# EAGLE design Visulizer (EAGLE 5.11)
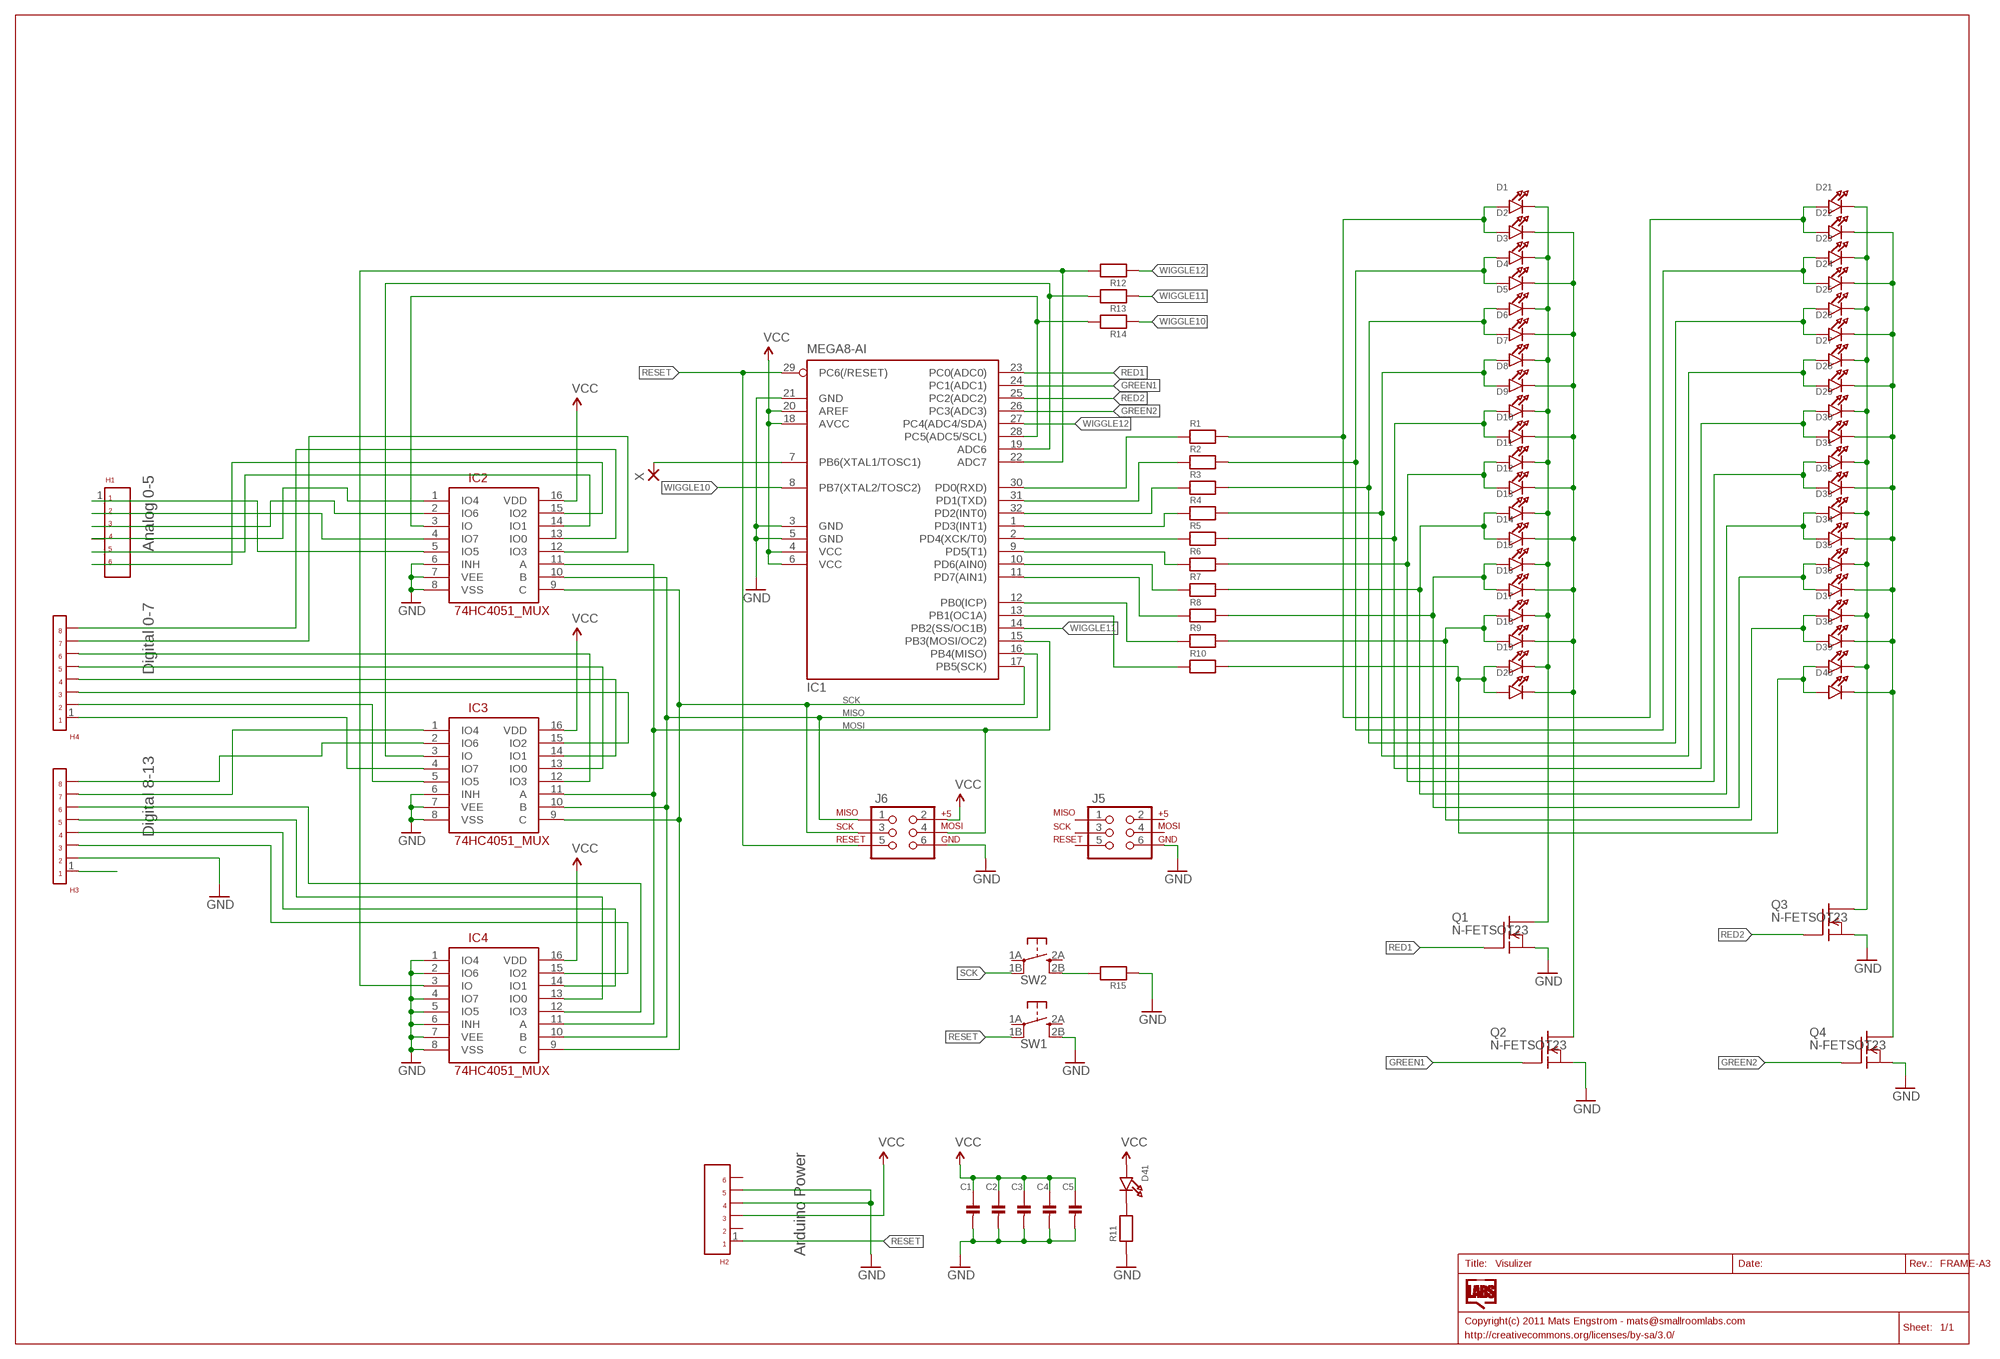
[diagram p0: schematic, sheet 1]

## Parts
C1  CAP_CERAMIC0805  [0805]
C2  CAP_CERAMIC0805  [0805]
C3  CAP_CERAMIC0805  [0805]
C4  CAP_CERAMIC0805  [0805]
C5  CAP_CERAMIC0805  [0805]
D1  LEDSMD0805  [CHIPLED_0805]
D2  LEDSMD0805  [CHIPLED_0805]
D3  LEDSMD0805  [CHIPLED_0805]
D4  LEDSMD0805  [CHIPLED_0805]
D5  LEDSMD0805  [CHIPLED_0805]
D6  LEDSMD0805  [CHIPLED_0805]
D7  LEDSMD0805  [CHIPLED_0805]
D8  LEDSMD0805  [CHIPLED_0805]
D9  LEDSMD0805  [CHIPLED_0805]
D10  LEDSMD0805  [CHIPLED_0805]
D11  LEDSMD0805  [CHIPLED_0805]
D12  LEDSMD0805  [CHIPLED_0805]
D13  LEDSMD0805  [CHIPLED_0805]
D14  LEDSMD0805  [CHIPLED_0805]
D15  LEDSMD0805  [CHIPLED_0805]
D16  LEDSMD0805  [CHIPLED_0805]
D17  LEDSMD0805  [CHIPLED_0805]
D18  LEDSMD0805  [CHIPLED_0805]
D19  LEDSMD0805  [CHIPLED_0805]
D20  LEDSMD0805  [CHIPLED_0805]
D21  LEDSMD0805  [CHIPLED_0805]
D22  LEDSMD0805  [CHIPLED_0805]
D23  LEDSMD0805  [CHIPLED_0805]
D24  LEDSMD0805  [CHIPLED_0805]
D25  LEDSMD0805  [CHIPLED_0805]
D26  LEDSMD0805  [CHIPLED_0805]
D27  LEDSMD0805  [CHIPLED_0805]
D28  LEDSMD0805  [CHIPLED_0805]
D29  LEDSMD0805  [CHIPLED_0805]
D30  LEDSMD0805  [CHIPLED_0805]
D31  LEDSMD0805  [CHIPLED_0805]
D32  LEDSMD0805  [CHIPLED_0805]
D33  LEDSMD0805  [CHIPLED_0805]
D34  LEDSMD0805  [CHIPLED_0805]
D35  LEDSMD0805  [CHIPLED_0805]
D36  LEDSMD0805  [CHIPLED_0805]
D37  LEDSMD0805  [CHIPLED_0805]
D38  LEDSMD0805  [CHIPLED_0805]
D39  LEDSMD0805  [CHIPLED_0805]
D40  LEDSMD0805  [CHIPLED_0805]
D41  LED0805  [CHIPLED_0805]
H1  HEADER1X06-F  [1X06_OVAL]
H2  HEADER1X06-F  [1X06_OVAL]
H3  HEADER1X08-F  [1X08_OVAL]
H4  HEADER1X08-F  [1X08_OVAL]
IC1  MEGA8-AI  [TQFP32-08]
IC2  74HC4051_MUX  [SO16]
IC3  74HC4051_MUX  [SO16]
IC4  74HC4051_MUX  [SO16]
J5  AVR_SPI_PRG_6NS  [2X3-NS]
J6  AVR_SPI_PRG_6NS  [2X3-NS]
Q1  N-FETSOT23  [SOT23]
Q2  N-FETSOT23  [SOT23]
Q3  N-FETSOT23  [SOT23]
Q4  N-FETSOT23  [SOT23]
R1  RESISTOR0805  [0805]
R2  RESISTOR0805  [0805]
R3  RESISTOR0805  [0805]
R4  RESISTOR0805  [0805]
R5  RESISTOR0805  [0805]
R6  RESISTOR0805  [0805]
R7  RESISTOR0805  [0805]
R8  RESISTOR0805  [0805]
R9  RESISTOR0805  [0805]
R10  RESISTOR0805  [0805]
R11  RESISTOR0805  [0805]
R12  RESISTOR0805  [0805]
R13  RESISTOR0805  [0805]
R14  RESISTOR0805  [0805]
R15  RESISTOR0805  [0805]
SW1  TACTILE  [EVQ-Q2]
SW2  TACTILE  [EVQ-Q2]
X  WIREPAD1,6/0,8  [1,6/0,8]

## Nets
GND [power]: C1.2 C2.2 C3.2 C4.2 C5.2 H2.4 H2.5 H3.2 IC1.3(GND) IC1.5(GND) IC1.21(GND) IC2.6(INH) IC2.7(VEE) IC2.8(VSS) IC3.6(INH) IC3.7(VEE) IC3.8(VSS) IC4.1(IO4) IC4.2(IO6) IC4.4(IO7) IC4.5(IO5) IC4.6(INH) IC4.7(VEE) IC4.8(VSS) J5.6 J6.6 Q1.2(S) Q2.2(S) Q3.2(S) Q4.2(S) R11.1 R15.1 SW1.2B
GREEN1: IC1.24(PC1(ADC1)) Q2.1(G)
GREEN1BUS: D2.C D4.C D6.C D8.C D10.C D12.C D14.C D16.C D18.C D20.C Q2.3(D)
GREEN2: IC1.26(PC3(ADC3)) Q4.1(G)
GREEN2BUS: D22.C D24.C D26.C D28.C D30.C D32.C D34.C D36.C D38.C D40.C Q4.3(D)
MISO: IC1.16(PB4(MISO)) IC2.10(B) IC3.10(B) IC4.10(B) J6.1
MOSI: IC1.15(PB3(MOSI/OC2)) IC2.11(A) IC3.11(A) IC4.11(A) J6.4
MUX1: IC1.28(PC5(ADC5/SCL)) IC2.3(IO) R14.2
MUX2: IC1.19(ADC6) IC3.3(IO) R13.2
MUX3: IC1.22(ADC7) IC4.3(IO) R12.2
N$1: H1.1 IC2.5(IO5)
N$2: H1.2 IC2.4(IO7)
N$3: H1.3 IC2.2(IO6)
N$4: H1.4 IC2.1(IO4)
N$5: H1.5 IC2.14(IO1)
N$6: H1.6 IC2.15(IO2)
N$7: H4.8 IC2.13(IO0)
N$8: H4.7 IC2.12(IO3)
N$9: H4.6 IC3.12(IO3)
N$10: H4.5 IC3.13(IO0)
N$11: H4.4 IC3.14(IO1)
N$12: H4.3 IC3.15(IO2)
N$13: H4.2 IC3.5(IO5)
N$14: H4.1 IC3.4(IO7)
N$15: H3.8 IC3.2(IO6)
N$16: H3.7 IC3.1(IO4)
N$17: R15.2 SW2.2B
N$18: H3.1
N$19: H3.3 IC4.15(IO2)
N$20: H3.6 IC4.12(IO3)
N$21: IC1.30(PD0(RXD)) R1.1
N$25: IC1.31(PD1(TXD)) R2.1
N$27: IC1.32(PD2(INT0)) R3.1
N$28: IC1.1(PD3(INT1)) R4.1
N$29: IC1.2(PD4(XCK/T0)) R5.1
N$30: IC1.9(PD5(T1)) R6.1
N$31: IC1.10(PD6(AIN0)) R7.1
N$32: IC1.11(PD7(AIN1)) R8.1
N$33: IC1.12(PB0(ICP)) R9.1
N$34: IC1.13(PB1(OC1A)) R10.1
N$37: IC1.7(PB6(XTAL1/TOSC1)) X.1(P)
N$38: D41.C R11.2
N$40: H3.5 IC4.13(IO0)
N$41: H3.4 IC4.14(IO1)
N$46: D15.A D16.A D35.A D36.A R8.2
N$47: D17.A D18.A D37.A D38.A R9.2
N$48: D19.A D20.A D39.A D40.A R10.2
N$52: D1.A D2.A D21.A D22.A R1.2
N$53: D3.A D4.A D23.A D24.A R2.2
N$54: D5.A D6.A D25.A D26.A R3.2
N$55: D7.A D8.A D27.A D28.A R4.2
N$56: D9.A D10.A D29.A D30.A R5.2
N$57: D11.A D12.A D31.A D32.A R6.2
N$58: D13.A D14.A D33.A D34.A R7.2
RED1: IC1.23(PC0(ADC0)) Q1.1(G)
RED1BUS: D1.C D3.C D5.C D7.C D9.C D11.C D13.C D15.C D17.C D19.C Q1.3(D)
RED2: IC1.25(PC2(ADC2)) Q3.1(G)
RED2BUS: D21.C D23.C D25.C D27.C D29.C D31.C D33.C D35.C D37.C D39.C Q3.3(D)
RESET: H2.1 IC1.29(PC6(/RESET)) J6.5 SW1.1B
SCK: IC1.17(PB5(SCK)) IC2.9(C) IC3.9(C) IC4.9(C) J6.3 SW2.1B
VCC [power]: C1.1 C2.1 C3.1 C4.1 C5.1 D41.A H2.3 IC1.4(VCC) IC1.6(VCC) IC1.18(AVCC) IC1.20(AREF) IC2.16(VDD) IC3.16(VDD) IC4.16(VDD) J6.2
WIGGLE10: IC1.8(PB7(XTAL2/TOSC2)) R14.1
WIGGLE11: IC1.14(PB2(SS/OC1B)) R13.1
WIGGLE12: IC1.27(PC4(ADC4/SDA)) R12.1
Unconnected: H2.2 H2.6 J5.1 J5.2 J5.3 J5.4 J5.5 SW1.1A SW1.2A SW2.1A SW2.2A

## Notes on the sheet
- Analog 0-5
- Digital 0-7
- Digital 8-13
- Arduino Power

## Library data of the parts
C1-C5 = microbuilder:CAP_CERAMIC: Ceramic Capacitors 0402 - 0402 Surface Mount Capacitors 0.1uF 10V 10% [Digikey: 490-1318-2-ND] 0603 - 0603 Surface Mount Capacitors 16 pF 50V 5% [Digikey: 445-5051-2-ND] 22 pF 50V [Digikey: PCC220ACVTR-ND] 33 pF 50V 5% [Digikey: 490-1415-1-ND] 56pF 50V 5% [Digikey: 490-1421-1-ND] 220pF 50V 5% [Digikey: 445-1285-1-ND] 680 pF 50V 2200 pF 50V 5% C0G [Digikey: 445-1297-1-ND] 5600 pF 100V 5% X7R [Digikey: 478-3711-1-ND] 0.1 µF 25V 10% [Digikey: PCC2277TR-ND] 0.22 µF 16V 10% X7R [Digikey: 445-1318-1-ND] 1.0 µF 25V 10% [Digikey: 445-5146-2-ND] 0603 - RF Specific 3pF 250V +/-0.1pF RF [Digikey: 712-1347-1-ND] 18 pF 250V 5% [Digikey: 478-3505-1-ND or 712-1322-1-ND] 56 pF 250V 5% C0G RF [Digikey: 490-4867-1-ND] 68 pF 250V RF [Digikey: 490-4868-1-ND] 0805 - 0805 Surface Mount Capacitors 220 pF 250V 2% RF Ceramic Capacitor [Digikey: 712-1398-1-ND] 1000 pF 50V 2% NP0 Ceramic Capacitor [Digikey: 478-3760-1-ND] 0.1 µF 25V 10% Ceramic Capacitor [Digikey: PCC1828TR-ND] 1.0 µF 16V 10% Ceramic Capacitor[Digikey: 490-1691-2-ND] 10.0 µF 10V 10% Ceramic Capacitor[Digikey: 709-1228-1-ND] 1206 - 1206 Surface Mount Capacitors
D1-D40 = SmallRoomLabs:LED
D41 = microbuilder:LED: LED 0603 - 0603 Surface Mount Package Green LED - Low Power (3.9mcd, 2ma, 1.7Vf) Orange LED - Low Power (9.8mcd, 2ma, 1.8Vf) Red LED - Low Power (5mcd, 2ma, 1.8Vf) Yellow LED - Low Power (7mcd, 2ma, 1.8Vf) 0805 - 0805 Surface Mount Package 20mA: Red LED (104mcd, 20mA, Diffused) - LS R976 [Digikey: 475-1278-6-ND] Red LED (12mcd, 20mA, 2.0Vf, Clear) - APT2012EC [Digikey: 754-1128-1-ND] Green LED (15mcd, 20mA, 2.2Vf, Clear) - APT2012GC [Digikey: 754-1131-1-ND] Orange LED (160mcd, 20mA, 2.1Vf, Clear) - APT2012SECK [Digikey: 754-1130-1-ND] 2mA: Red LED (8.8mcd, 2mA, 1.8Vf, Clear) - Low Power [Digikey: 475-2510-1-ND] Green LED (5mcd, 2mA, 1.8Vf, Clear) - Low Power [Digikey: 475-2730-1-ND] Yellow LED (11.3mcd, 2mA, 1.8Vf, Clear) - Low Power [Digikey: 475-2555-1-ND] 1206 - 1206 Surface Mount Package Green LED (26mcd, 20mA, Diffused) - LG N971 [Digikey: 475-1407-6-ND] Red LED (15mcd, 20mA, Diffused) - LH N974 [Digikey: 475-1416-6-ND]
H1 H2 = SmallRoomLabs:HEADER1X06; EAGLEUP: F1X6
H3 H4 = SmallRoomLabs:HEADER1X08; EAGLEUP: F1X8
IC1 = atmel:MEGA8: MICROCONTROLLER 8 Kbytes FLASH, 1 kbytes SRAM, 512 bytes EEPROM, USART, 6-channel 10 bit ADC, 2-channel 8 bit ADC Pin compatible with Atmega48, ATMega88, ATMega168 Source: avr.lbr; MPN: ATMEGA8-16AU; OC_FARNELL: 9171371; OC_NEWARK: 73M8863
IC2-IC4 = SparkFun:74HC4051_MUX
J5 J6 = SparkFun:AVR_SPI_PRG_6: AVR ISP 6 Pin This is the reduced ISP connector for AVR programming. Common on Arduino. This footprint will take up less PCB space and can be used with a 10-pin to 6-pin adapter such as SKU: BOB-08508
Q1-Q4 = SmallRoomLabs:N-FET
R1-R15 = microbuilder:RESISTOR: Resistors 0402 - 0402 Surface Mount Package 10.0K 1% 1/16W [Digikey: 311-10.0KLRTR-ND] 0603 - 0603 Surface Mount Package 0 Ohm 1/10 Watt 1% Resistor 15 Ohm 1/10 Watt 1% Resistor 33 Ohm 1/10 Watt 1% Resistor 49.9 Ohm 1/10 Watt 1% Resistor 100 Ohm 1/10 Watt 1% Resistor 150 Ohm 1/10 Watt 1% Resistor 240 Ohm 1/10 Watt 1% Resistor 390 Ohm 1/10 Watt 1% Resistor 560 Ohm 1/10 Watt 1% Resistor 750 Ohm 1/10 Watt 1% Resistor 1.0K Ohm 1/10 Watt 1% Resistor 1.5K Ohm 1/10 Watt 1% Resistor 2.0K Ohm 1/10 Watt 1% Resistor 4.7K Ohm 1/10 Watt 1% Resistor 10.0K Ohm 1/10 Watt 1% Resistor 20.0K Ohm 1/10 Watt 1% Resistor 33.0K Ohm 1/10 Watt 1% Resistor 100.0K Ohm 1/10 Watt 1% Resistor 0805 - 0805 Surface Mount Package 0 Ohm 1/8 Watt 1% Resistor 33 Ohm 1/8 Watt 1% Resistor 100 Ohm 1/8 Watt 1% Resistor 150 Ohm 1/8 Watt 1% Resistor 200 Ohm 1/8 Watt 1% Resistor 240 Ohm 1/8 Watt 1% Resistor 330 Ohm 1/8 Watt 1% Resistor 390 Ohm 1/8 Watt 1% Resistor 470 Ohm 1/8 Watt 1% Resistor 1.0K Ohm 1/8 Watt 1% Resistor 1.5K Ohm 1/8 Watt 1% Resistor 2.0K Ohm 1/8 Watt 1% Resistor 4.7K Ohm 1/8 Watt 1% Resistor 5.1K Ohm 1/8 Watt 1% Resistor 5.6K Ohm 1/8 Watt 1% Resistor 10.0K Ohm 1/8 Watt 1% Resistor 22.0K Ohm 1/8 Watt 1% Resistor 33.0K Ohm 1/8 Watt 1% Resistor 100K Ohm 1/8 Watt 1% Resistor 1206 - 1206 Surface Mount Package
SW1 SW2 = SmallRoomLabs:TACTILE
X = wirepad:WIREPAD: Wire PAD connect wire on PCB

## Net classes
0 default: width 0.203 mm, drill 0.305 mm, clearance 0.203 mm
1 power: width 0.203 mm, drill 0.305 mm, clearance 0.203 mm

## Board
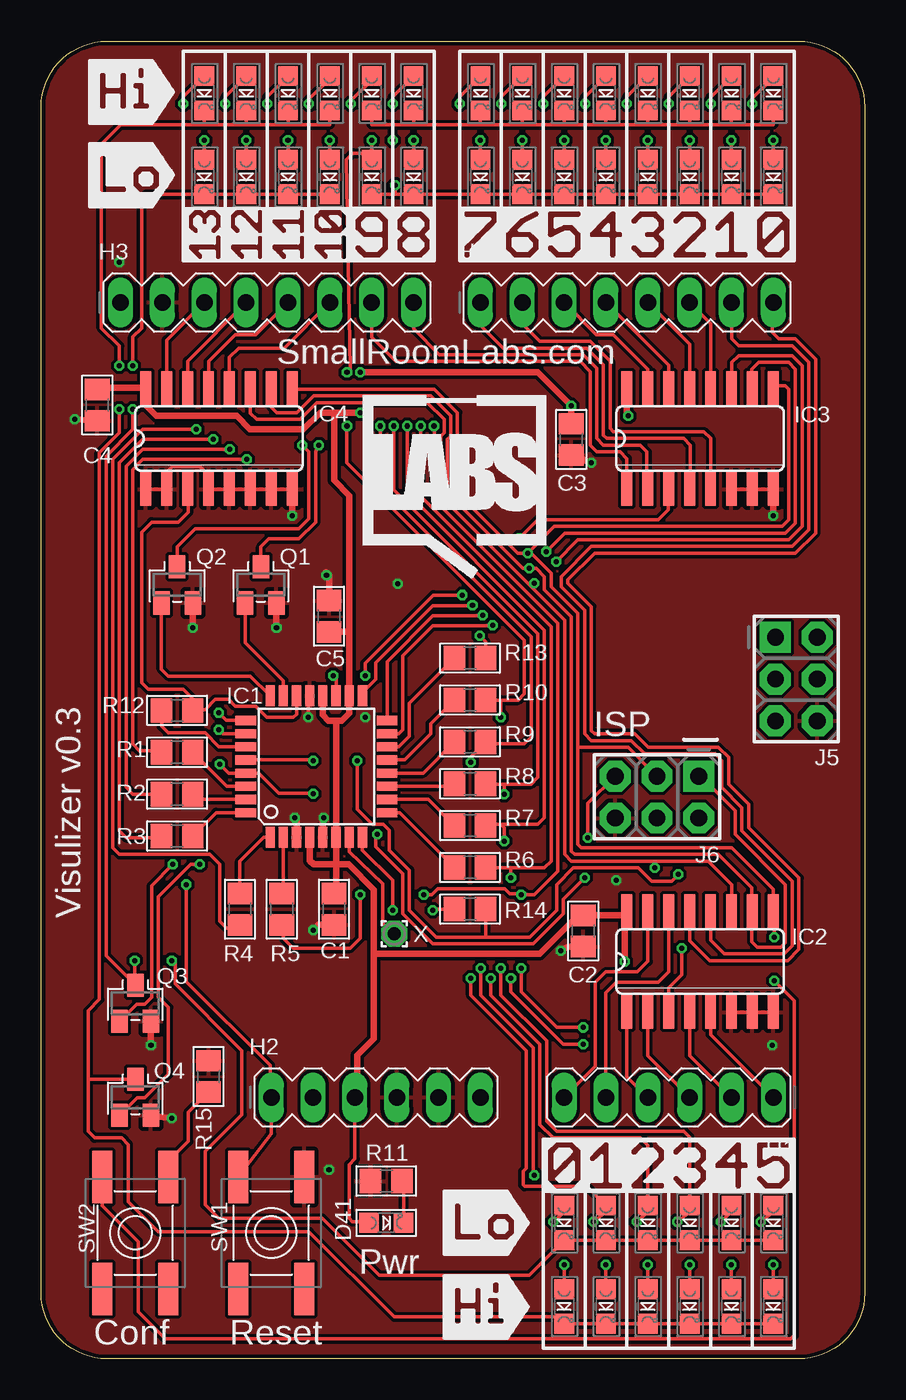
[diagram p1: board, top side]
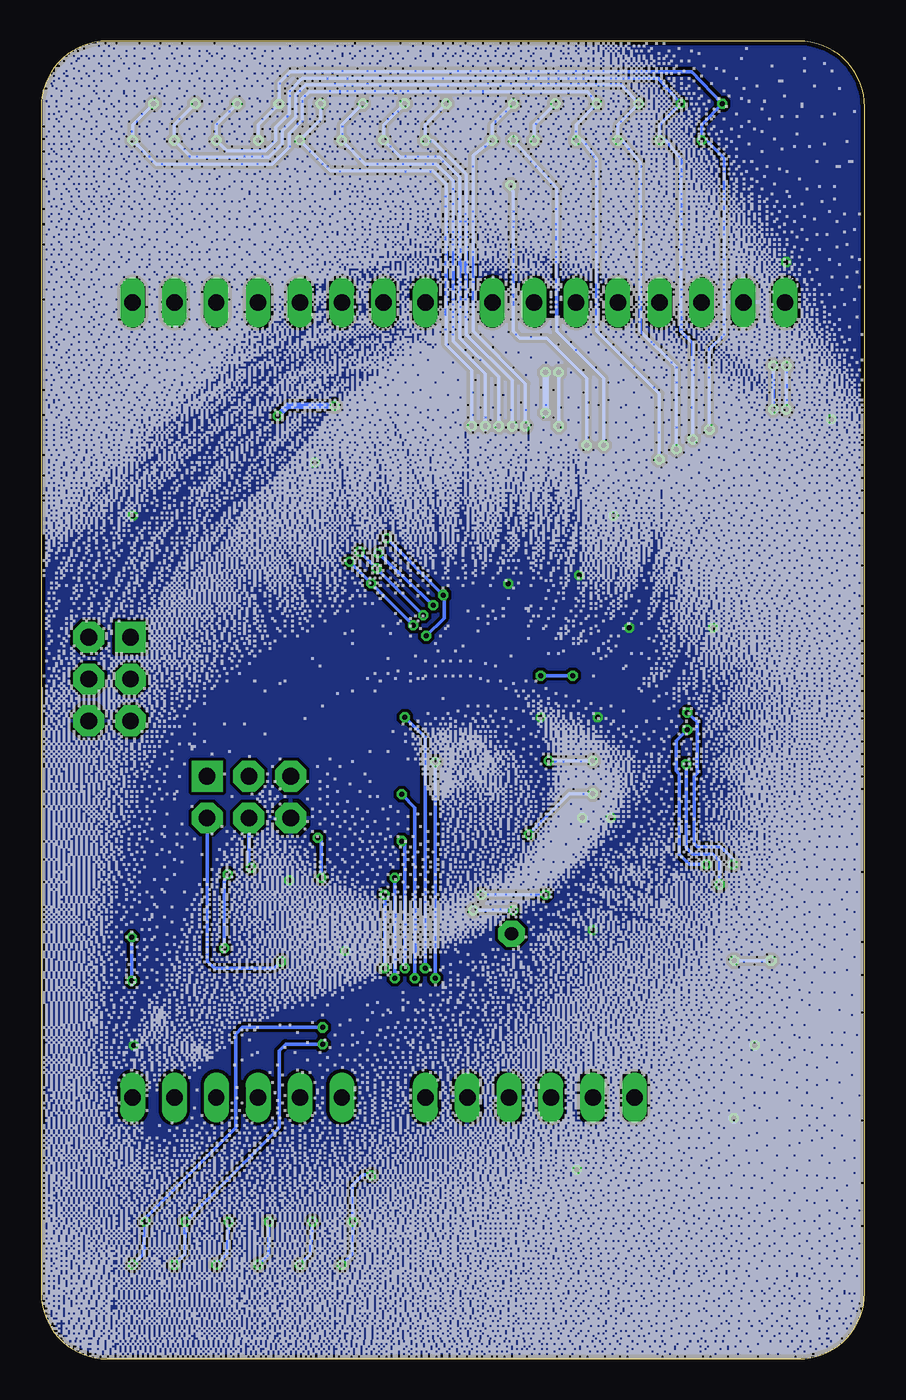
[diagram p2: board, bottom side, seen from below]

Size 50 x 80 mm. Coordinates in mm from the lower left corner, seen from the top.
Outline: 46,80 arc-90 50,76 50,4 arc-90 46,0 4,0 arc-90 0,4 0,76 arc-90 4,80 46,80
Copper layers (1*16): Top 0.035mm / dielectric 1.5mm / Bottom 0.035mm
Design rules "Fusion_eagle_rule_v1.1": minimum track width 6mil, minimum drill 12mil, track to track 6mil, track to pad 6mil, pad to pad 6mil, via to via 6mil, smd to smd 0mil, copper to edge 10mil, drill to drill 10mil, minimum pad ring 10mil, minimum via ring 6mil, stop-mask expansion 2mil, vias tented up to drill 100mil, thermal gap 10mil

### Footprints (pad centres in the part's own frame; a part is rotated, then mirrored left to right if it is on the bottom)
0805 = smd 1.3 x 1.5: 1 -0.95,0; 2 0.95,0
CHIPLED_0805 = smd 1.2 x 1.2: A 0,-1.05; C 0,1.05
1X06_OVAL = drill 1 long: 1 0,0; 2 2.54,0; 3 5.08,0; 4 7.62,0; 5 10.16,0; 6 12.7,0
1X08_OVAL = drill 1 long: 1 0,0; 2 2.54,0; 3 5.08,0; 4 7.62,0; 5 10.16,0; 6 12.7,0; 7 15.24,0; 8 17.78,0
TQFP32-08 = smd 1.27 x 0.559: 1 -4.293,2.8; 2 -4.293,2; 3 -4.293,1.2; 4 -4.293,0.4; 5 -4.293,-0.4; 6 -4.293,-1.2; 7 -4.293,-2; 8 -4.293,-2.8; 17 4.293,-2.8; 18 4.293,-2; 19 4.293,-1.2; 20 4.293,-0.4; 21 4.293,0.4; 22 4.293,1.2; 23 4.293,2; 24 4.293,2.8 | smd 0.559 x 1.27: 9 -2.8,-4.293; 10 -2,-4.293; 11 -1.2,-4.293; 12 -0.4,-4.293; 13 0.4,-4.293; 14 1.2,-4.293; 15 2,-4.293; 16 2.8,-4.293; 25 2.8,4.293; 26 2,4.293; 27 1.2,4.293; 28 0.4,4.293; 29 -0.4,4.293; 30 -1.2,4.293; 31 -2,4.293; 32 -2.8,4.293
SO16 = smd 0.66 x 2.032: 1 -4.445,-3.073; 2 -3.175,-3.073; 3 -1.905,-3.073; 4 -0.635,-3.073; 5 0.635,-3.073; 6 1.905,-3.073; 7 3.175,-3.073; 8 4.445,-3.073; 9 4.445,3.073; 10 3.175,3.073; 11 1.905,3.073; 12 0.635,3.073; 13 -0.635,3.073; 14 -1.905,3.073; 15 -3.175,3.073; 16 -4.445,3.073
2X3-NS = drill 1.016 pad 1.88 square: 1 -2.54,-1.27 | drill 1.016 pad 1.88 octagon: 2 -2.54,1.27; 3 0,-1.27; 4 0,1.27; 5 2.54,-1.27; 6 2.54,1.27
SOT23 = smd 1 x 1.4: 1 -0.95,-1.1; 2 0.95,-1.1; 3 0,1.1
EVQ-Q2 = smd 3.2 x 1.2: 1A -3.4,2; 1B 3.4,2; 2A -3.4,-2; 2B 3.4,-2
1,6/0,8 = drill 0.813 pad 1.6 octagon: 1 0,0

### Placement (x,y rotation side)
C1  17.78,27.3 270 top
C2  32.91,25.98 270 top
C3  32.18,55.82 270 top
C4  3.4,57.91 270 top
C5  17.48,45.09 90 top
D1  44.45,71.75 180 top
D2  44.45,76.83 180 top
D3  41.91,71.75 180 top
D4  41.91,76.83 180 top
D5  39.37,71.75 180 top
D6  39.37,76.83 180 top
D7  36.83,71.75 180 top
D8  36.83,76.83 180 top
D9  34.29,71.75 180 top
D10  34.29,76.83 180 top
D11  31.75,71.75 180 top
D12  31.75,76.83 180 top
D13  29.21,71.75 180 top
D14  29.21,76.83 180 top
D15  26.67,71.75 180 top
D16  26.67,76.83 180 top
D17  22.61,71.75 180 top
D18  22.61,76.83 180 top
D19  20.07,71.75 180 top
D20  20.07,76.83 180 top
D21  17.53,71.75 180 top
D22  17.53,76.83 180 top
D23  14.99,71.75 180 top
D24  14.99,76.83 180 top
D25  12.45,71.75 180 top
D26  12.45,76.83 180 top
D27  9.91,71.75 180 top
D28  9.91,76.83 180 top
D29  44.45,8.26 180 top
D30  44.45,3.17 180 top
D31  41.91,8.26 180 top
D32  41.91,3.17 180 top
D33  39.37,8.26 180 top
D34  39.37,3.17 180 top
D35  36.83,8.26 180 top
D36  36.83,3.17 180 top
D37  34.29,8.26 180 top
D38  34.29,3.17 180 top
D39  31.75,8.26 180 top
D40  31.75,3.17 180 top
D41  20.95,8.26 270 top
H1  44.45,15.88 180 top
H2  13.97,15.88 0 top
H3  4.83,64.14 0 top
H4  26.67,64.14 0 top
IC1  16.7,35.96 90 top
IC2  40.01,24.12 0 top
IC3  40.01,55.87 0 top
IC4  10.79,55.87 0 top
J5  45.85,41.27 270 top
J6  37.39,34.11 180 top
Q1  13.34,46.99 0 top
Q2  8.26,46.99 0 top
Q3  5.71,21.59 0 top
Q4  5.71,15.88 0 top
R1  8.26,36.82 180 top
R2  8.26,34.28 180 top
R3  8.26,31.74 180 top
R4  12.06,27.3 270 top
R5  14.61,27.3 270 top
R6  26.04,29.84 0 top
R7  26.04,32.38 0 top
R8  26.04,34.92 0 top
R9  26.04,37.46 0 top
R10  26.04,40 0 top
R11  20.95,10.79 0 top
R12  8.26,39.37 0 top
R13  26.04,42.55 0 top
R14  26.04,27.3 0 top
R15  10.16,17.14 270 top
SW1  13.97,7.65 90 top
SW2  5.71,7.65 90 top
U$1  [SRL-LOGO-SILK-10MM]  19.53,47.37 0 top
U$3  [ARDUINO-REFONLY]  -19.05,13.34 0 top  (outside the outline)
X  21.44,25.81 0 top

### Tracks (layer width: path | path; a pad name or v marks a point on that pad's centre or on a via)
GND  (via drill 0.3)
  Top 0.203: IC2.6 IC2.7 IC2.8 44.6,21.05 | IC1.21 16.22,40.17 v16.22,38.96 | IC4.8 IC4.7 IC4.6 IC4.5 IC4.4 10.03,52.93 10.03,53.79 9.63,54.2 8,54.2 7.62,53.82 IC4.2 IC4.1 | IC3.8 IC3.7 IC3.6 | 17.1,32.79 v17.14,32.86
  Top 0.406: v15.41,32.86 15.5,32.77 IC1.3 | C3.2 v33.4,54.4 | IC4.8 v15.24,51.2 | IC3.8 v44.45,51.2 | v2.03,57.04 C4.2 | IC1.5 17.1,32.79 | Q2.2 9.21,44.45 v9.21,44.4 | Q1.2 14.29,44.45 v14.29,44.4 | v6.67,19.05 Q3.2 | v7.94,14.61 Q4.2 | v16.51,26.04 16.82,26.35 C1.2 | v31.55,24.77 32.01,25.03 C2.2 | C5.2 17.48,47.55 17.27,47.75
  other vias: 44.37,19.04 17.32,47.57 17.48,11.48 34.92,29.05 4.75,66.59 19.68,38.96 21.64,47.07
  pour Bottom: 25,80 46,80 arc-90 50,76 50,42 50,4 arc-90 46,0 24,0 4,0 arc-90 0,4 0,40 0,76 arc-90 4,80
  pour Top: 25,80 46,80 arc-90 50,76 50,35 50,4 arc-90 46,0 23,0 4,0 arc-90 0,4 0,45 0,76 arc-90 4,80
GREEN1
  Top 0.203: IC1.24 12.7,41.45 7.72,41.45 7.3,41.87 Q2.1
GREEN1BUS  (via drill 0.3)
  Top 0.203: D2.C 44.37,75.51 | D2.C 44.5,75.64 | v15.85,55.47 16.26,55.07 16.26,51 15.65,50.39 9.35,50.39 8.26,49.3 Q2.3 | D2.C 44.45,74.93 41.91,74.93 | 22.61,74.93 26.67,74.93 | 26.67,74.93 29.21,74.93 | 29.21,74.93 31.75,74.93 | 31.75,74.93 34.29,74.93 | 34.29,74.93 36.83,74.93 | 36.83,74.93 39.37,74.93 | 39.37,74.93 41.91,74.93 | D20.C 20.07,74.93 21.34,74.93 | 22.61,74.93 D18.C | 26.67,74.93 D16.C | 29.21,74.93 D14.C | 31.75,74.93 D12.C | 34.29,74.93 D10.C | 36.83,74.93 D8.C | 39.37,74.93 D6.C | 41.91,74.93 D4.C | 21.34,74.93 22.61,74.93 | v21.34,73.98 21.34,74.93
  Bottom 0.203: v15.85,55.47 15.85,59.54 18.69,62.38 18.69,71.08 v21.34,73.98
GREEN2  (via drill 0.3)
  Top 0.203: v9.63,30.02 9.09,30.02 7.11,28.04 7.11,21.95 7.72,21.34 7.72,17.27 6.3,15.85 5.84,15.85 Q4.1 | IC1.26 11.01,37.96 v10.77,38.2
  Bottom 0.203: v10.77,38.2 11.46,37.53 11.46,35.71 11.25,35.5 11.25,30.63 10.64,30.02 v9.63,30.02
GREEN2BUS  (via drill 0.3)
  Top 0.203: D30.C D32.C D34.C D36.C D38.C D40.C 31.34,2.54 21.44,2.54 16.26,7.72 7.11,7.72 5.28,9.55 5.28,13.01 4.88,13.41 3.25,13.41 2.85,13.82 2.85,17.07 | D28.C 9.75,75.44 | v4.75,57.65 4.75,56.23 3.53,55.01 3.53,21.82 2.85,21.13 2.85,17.07 | D28.C 9.44,75.51 | v4.75,60.29 4.75,61.49 3.66,62.59 3.66,73.75 4.84,74.93 9.91,74.93 | D28.C 9.81,75.51 | 5.62,17.07 Q4.3 2.94,16.98 2.85,17.07 | 9.91,74.93 D28.C | 9.91,74.93 12.45,74.93 | 12.45,74.93 14.99,74.93 | 14.99,74.93 17.53,74.93 D22.C | 14.99,74.93 D24.C | 12.45,74.93 D26.C
  Bottom 0.203: v4.75,57.65 v4.75,60.29
MISO  (via drill 0.3)
  Top 0.203: IC4.10 13.97,57.78 14.3,57.45 15.52,57.45 16.54,58.46 23.65,58.46 24.87,57.24 24.87,56.03 24.66,55.82 24.66,52.57 29.23,48 v29.64,48 30.05,48 30.56,47.49 30.56,46.68 32.18,45.05 32.18,30.83 32.38,30.63 41.12,30.63 43.16,28.59 43.16,27.22 IC2.10 43.16,27.17 43.16,25.32 43.48,24.99 44.91,24.99 45.19,25.27 45.19,28.8 42.14,31.84 42.14,33.27 40.72,34.69 40.62,34.69 J6.1 | IC3.10 43.16,58.97 43.16,60.09 43.56,60.5 45.39,60.5 45.8,60.09 45.8,50.74 45.19,50.13 31.77,50.13 v30.66,49.02 | IC1.16 21,42.33 23.77,45.11 26.75,45.11 v26.8,45.16
  Bottom 0.203: v26.8,45.16 v29.64,48 v30.66,49.02
MOSI  (via drill 0.3)
  Top 0.203: IC4.11 12.7,57.42 13.08,57.04 15.72,57.04 16.74,58.06 23.44,58.06 24.46,57.04 24.46,56.23 24.26,56.03 24.26,52.37 29.74,46.88 | IC2.11 41.94,27.22 41.94,28.8 40.51,30.22 37.26,30.22 | 37.26,30.22 32.18,30.22 31.77,30.63 31.77,44.85 29.74,46.88 | 37.26,30.22 v37.26,29.81 | IC3.11 41.94,58.97 41.94,60.5 42.34,60.9 45.59,60.9 46.2,60.29 46.2,50.54 45.39,49.73 32.59,49.73 v31.27,48.41 | v29.95,47.09 29.74,46.88 | 21.02,37.94 IC1.15 21.7,37.96 21.95,38.2 21.95,42.67 23.77,44.5 27.36,44.5 v27.41,44.55
  Bottom 0.203: v27.41,44.55 v29.95,47.09 v31.27,48.41 | J6.4 37.39,29.94 v37.26,29.81
MUX1  (via drill 0.3)
  Top 0.203: IC2.3 38.1,22.52 38.89,23.31 v38.89,24.94 | IC1.28 16.26,36.36 v16.51,36.31 | v19.18,36.31 19.18,33.37 20.09,32.45 20.78,32.45 21.13,32.11 21.13,30.89 22.35,29.67 22.35,27.23 23.98,25.6 27.03,25.6 | v38.68,29.41 38.28,29 37.06,29 36.25,29.81 32.31,29.81 31.29,28.8 31.29,27.23 29.67,25.6 27.03,25.6 | R14.2 26.98,25.64 27.03,25.6
  Bottom 0.203: v38.89,24.94 38.89,29 v38.68,29.41 | v16.51,36.31 v19.18,36.31
MUX2  (via drill 0.3)
  Top 0.203: IC1.19 17.9,41.31 v17.73,41.48 | v29.03,49.83 30.15,50.95 37.47,50.95 38.08,51.55 38.08,52.77 IC3.3 | v19.67,41.48 19.67,42.23 23.82,46.37 v25.58,46.37 | v26.62,43.89 26.98,43.52 R13.2
  Bottom 0.203: v17.73,41.48 v19.67,41.48 | v29.03,49.83 v25.58,46.37 25.53,46.33 25.53,44.98 v26.62,43.89
MUX3
  Top 0.203: IC1.22 15.5,39.15 15.32,38.96 13.69,38.96 13.02,39.62 11.79,39.62 11.38,40.03 10.57,40.03 9.96,39.42 9.26,39.42 R12.2 9.23,40.03 8.62,40.64 6.5,40.64 6.1,41.05 6.1,50.19 6.71,50.8 8.33,50.8 8.94,51.41 8.94,52.75 IC4.3 8.81,52.72
N$1
  Top 0.203: IC2.5 40.64,19.68 H1.1
N$2
  Top 0.203: IC2.4 39.37,18.41 H1.2
N$3
  Top 0.203: IC2.2 36.83,18.41 H1.3
N$4
  Top 0.203: IC2.1 35.56,17.14 H1.4
N$5
  Top 0.203: H1.5 34.29,22.22 34.92,22.85 37.47,22.85 38.1,23.49 IC2.14
N$6
  Top 0.203: IC2.15 36.83,24.12 36.2,23.49 34.29,23.49 33.66,22.85 33.66,17.77 H1.6
N$7
  Top 0.203: IC2.13 39.37,25.39 40.58,24.18 45.31,24.18 46,24.87 46,29.2 42.95,32.25 42.95,33.67 41.73,34.89 41.73,36.52 41.12,37.13 36.85,37.13 36.04,37.94 33.6,37.94 33.4,38.14 33.4,45.66 31.98,47.09 31.98,47.29 33.6,48.91 45.8,48.91 47.02,50.13 47.02,60.7 45.8,61.92 44.78,61.92 44.37,62.33 44.37,64.05 44.32,64.14 H4.8
N$8
  Top 0.203: IC2.12 40.64,25.42 41.47,24.59 45.11,24.59 45.59,25.07 45.59,29 42.55,32.05 42.55,33.47 41.33,34.69 41.33,36.31 40.92,36.72 36.65,36.72 35.84,37.53 33.4,37.53 32.99,37.94 32.99,45.46 31.57,46.88 31.57,47.49 33.4,49.32 45.59,49.32 46.61,50.34 46.61,60.5 45.59,61.51 42.34,61.51 41.94,61.92 41.94,64.1 H4.7
N$9
  Top 0.203: IC3.12 40.64,62.86 H4.6
N$10
  Top 0.203: IC3.13 39.37,61.59 H4.5
N$11
  Top 0.203: IC3.14 38.1,60.32 H4.4
N$12
  Top 0.203: IC3.15 36.83,60.1 34.75,62.18 33.7,62.18 H4.3
N$13
  Top 0.203: IC3.5 40.64,55.88 40.23,56.29 34.75,56.29 34.54,56.49 34.54,60.55 33.33,61.77 30.28,61.77 29.21,62.84 H4.2
N$14
  Top 0.203: IC3.4 39.42,52.85 39.42,55.47 39.01,55.88 34.34,55.88 34.14,56.08 34.14,60.35 33.12,61.37 28.04,61.37 26.67,62.74 H4.1
N$15
  Top 0.203: IC3.2 36.78,52.85 36.78,55.07 36.37,55.47 34.14,55.47 33.73,55.88 33.73,60.15 32.92,60.96 24.18,60.96 22.61,62.53 H3.8
N$16
  Top 0.203: IC3.1 35.56,54.66 35.15,55.07 33.73,55.07 33.33,55.47 33.33,59.94 32.72,60.55 21.54,60.55 20.07,62.03 H3.7
N$17
  Top 0.203: R15.2 8.94,14.98 8.94,13.21 7.71,11.98 SW2.2B
N$19
  Top 0.203: IC4.15 7.62,61.84 H3.3
N$20
  Top 0.203: IC4.12 11.43,60.81 11.99,61.37 14.76,61.37 H3.6
N$21
  Top 0.203: IC1.30 11.27,34.76 R1.1
N$25
  Top 0.203: IC1.31 9.53,33.96 R2.1
N$27
  Top 0.203: IC1.32 10.62,33.16 R3.1
N$28
  Top 0.203: IC1.1 13.51,31.67 12.06,30.22 R4.1
N$29
  Top 0.203: IC1.2 14.7,28.35 R5.1
N$30
  Top 0.203: IC1.9 21.76,33.16 R6.1
N$31
  Top 0.203: IC1.10 23.5,33.96 R7.1
N$32
  Top 0.203: IC1.11 24.93,34.76 R8.1
N$33
  Top 0.203: IC1.12 23.19,35.56 R9.1
N$34
  Top 0.203: IC1.13 22.07,36.36 23.65,37.94 23.65,38.56 R10.1
N$37
  Top 0.203: IC1.7 18.7,30.77 20.73,28.85 20.73,26.43 X.1
N$38
  Top 0.203: D41.C 22,10.7 R11.2
N$40
  Top 0.203: IC4.13 10.16,60.55 11.79,62.18 13.04,62.18 H3.5
N$41
  Top 0.203: IC4.14 8.89,60.57 H3.4
N$46  (via drill 0.3)
  Top 0.203: v21.41,56.63 21.41,52.77 30.15,44.04 30.15,35.3 29.74,34.89 28.12,34.89 | 28.12,34.89 27.01,34.89 R8.2 | v28.12,34.28 28.12,34.89 | D36.A v36.83,5.71 | v36.17,8.33 36.83,8.89 D35.A 36.83,12.95 36.37,13.41 31.09,13.41 30.28,14.22 30.28,19.1 27.3,22.07 v27.3,23.11 | v26.67,73.98 D15.A | D16.A 25.4,76.61 v25.4,76.2
  Bottom 0.203: v27.3,23.11 27.3,33.47 v28.12,34.28 | v21.41,56.63 21.41,59.41 24.18,62.18 24.18,71.93 26.21,73.97 26.66,73.97 v26.67,73.98 26.67,74.93 v25.4,76.2 | v36.17,8.33 36.2,6.35 v36.83,5.71
N$47  (via drill 0.3)
  Top 0.203: v20.6,56.63 20.6,52.98 29.74,43.83 29.74,37.74 29.34,37.33 27.11,37.33 R9.2 | R9.2 26.98,37.85 | v26.09,36.21 26.09,36.56 R9.2 | D38.A v34.29,5.71 | v33.53,8.33 34.29,8.89 D37.A 33.12,10.48 29.35,10.48 29.26,10.57 29.26,11.38 29.46,11.58 29.46,18.69 26.09,22.07 v26.09,23.11 | v22.61,73.98 D17.A | D18.A 21.34,76.61 v21.34,76.2
  Bottom 0.203: v26.09,23.11 v26.09,36.21 | v20.6,56.63 20.6,59.21 23.77,62.38 23.77,73.06 v22.61,73.98 22.61,74.93 v21.34,76.2 | v33.53,8.33 33.66,6.35 v34.29,5.71
N$48  (via drill 0.3)
  Top 0.203: D20.A 20.03,77.61 18.8,76.37 v18.8,76.2 | 27.91,40 R10.2 26.7,40.29 | 27.91,40 28.96,40 29.34,40.38 29.34,43.63 18.57,54.4 v18.57,56.63 | v27.91,38.96 27.91,40 | v18.57,59.89 18.77,60.09 18.52,72.8 18.92,73.21 19.94,73.21 D19.A v20.07,73.98 | D40.A v31.75,5.71 | v31.09,8.33 31.75,8.89 D39.A | v26.7,23.72 26.7,22.07 29.87,18.9 29.87,11.21 v29.95,11.13
  Bottom 0.203: v18.57,56.63 v18.57,59.89 | v26.7,23.72 26.7,37.74 v27.91,38.96 | v31.75,5.71 31.11,6.35 v31.09,8.33 31.11,10.38 31.11,10.54 30.48,11.18 29.99,11.18 v29.95,11.13 | v18.8,76.2 20.07,74.93 v20.07,73.98
N$52  (via drill 0.3)
  Top 0.203: D2.A 44.26,77.61 43.18,76.53 v43.18,76.2 | D22.A 17.39,77.61 16.26,76.47 v16.26,76.2 | 7.2,36.72 R1.2 7.2,36.92 5.97,36.92 5.56,37.33 5.56,53.99 6.17,54.6 v12.47,54.6 | v17.53,73.98 D21.A | v44.45,73.98 D1.A
  Bottom 0.203: v12.47,54.6 12.47,58.6 16.26,62.38 16.26,72.83 17.15,73.98 v17.53,73.98 17.53,74.93 v16.26,76.2 16.82,76.94 33.73,76.94 34.14,76.53 34.14,75.18 34.95,74.37 34.95,73.56 35.97,72.54 43.02,72.54 v44.45,73.98 44.45,74.93 v43.18,76.2
N$53  (via drill 0.3)
  Top 0.203: v11.46,55.21 6.17,55.21 5.16,54.2 5.16,34.69 5.56,34.28 R2.2 | D4.A 41.73,77.7 40.64,76.61 v40.64,76.2 | 14.86,77.65 D24.A 13.72,76.61 v13.72,76.2 | v14.99,73.98 D23.A | v41.91,73.98 D3.A
  Bottom 0.203: v11.46,55.21 11.46,60.22 13.61,62.38 13.61,72.63 14.71,73.98 v14.99,73.98 14.99,74.93 v13.72,76.2 14.78,77.34 33.93,77.34 34.54,76.73 34.54,75.39 35.36,74.57 35.36,73.76 36.17,72.95 40.88,72.95 v41.91,73.98 41.91,74.93 v40.64,76.2
N$54  (via drill 0.3)
  Top 0.203: v10.44,55.82 6.17,55.82 4.75,54.4 4.75,32.05 5.16,31.64 7.2,31.64 R3.2 7.2,31.84 | v12.45,73.98 D25.A | v39.37,73.98 D5.A | D6.A 38.1,76.61 v38.1,76.2 | D26.A 11.18,76.61 v11.18,76.2
  Bottom 0.203: v10.44,55.82 10.44,61.65 11.18,62.38 11.18,72.83 12.07,73.98 v12.45,73.98 12.45,74.93 v11.18,76.2 12.55,77.75 34.14,77.75 34.95,76.94 34.95,75.59 35.76,74.78 35.76,73.97 36.37,73.36 38.75,73.36 v39.37,73.98 | v38.1,76.2 39.37,74.93 v39.37,73.98 | v39.37,73.98 39.36,73.97
N$55  (via drill 0.3)
  Top 0.203: 9.87,77.61 D28.A 8.64,76.61 v8.64,76.2 | v9.42,56.43 6.17,56.43 4.34,54.6 4.34,31.03 4.75,30.63 10.24,30.63 10.85,30.02 10.85,26.56 11.25,26.16 11.87,26.16 R4.2 | v9.91,73.98 D27.A | v36.83,73.98 D7.A | D8.A 35.56,76.61 v35.56,76.2
  Bottom 0.203: v9.42,56.43 9.42,61.29 8.53,62.18 8.53,72.88 9.63,73.98 v9.91,73.98 9.91,74.93 v8.64,76.2 10.52,78.16 34.87,78.16 35.56,77.47 v35.56,76.2 36.83,74.93 v36.83,73.98
N$56  (via drill 0.3)
  Top 0.203: v23.85,56.63 23.85,52.16 31.37,44.65 31.37,29.61 29.95,28.19 v29.13,28.19 29.08,28.25 28.45,28.25 28.14,28.55 24.08,28.55 23.72,28.19 v23.24,28.19 | v19.38,28.19 19.38,25.55 18.77,24.94 15.32,24.94 14.71,25.55 14.71,26.25 R5.2 | v44.45,5.71 D30.A | D29.A 44.45,8.89 v43.69,8.33 | v34.29,73.98 D9.A | D10.A 33.02,76.61 v33.02,76.2 | v32.92,20.12 31.29,20.12 29.13,22.28 v29.13,23.72
  Bottom 0.203: v19.38,28.19 v23.24,28.19 | v29.13,28.19 v29.13,23.72 | v23.85,56.63 23.85,60.02 25.4,61.57 25.4,71.32 26.21,72.14 32.45,72.14 v34.29,73.98 33.02,75.25 v33.02,76.2 | v44.45,5.71 43.81,6.35 v43.69,8.33 43.81,8.41 38.2,14.02 38.2,19.71 37.8,20.12 v32.92,20.12
N$57  (via drill 0.3)
  Top 0.203: v23.04,56.63 23.04,52.37 30.96,44.44 30.96,30.22 30.56,29.81 28.52,29.81 | 28.52,29.81 27.01,29.81 R6.2 | v28.52,29.2 28.52,29.81 | D32.A v41.91,5.71 | D31.A 41.91,8.89 v41.25,8.33 | v31.75,73.98 D11.A | D12.A 30.48,76.61 v30.48,76.2 | v32.92,19.1 31.7,19.1 28.52,22.28 v28.52,23.11
  Bottom 0.203: v28.52,23.11 v28.52,29.2 | v31.75,73.98 31.66,74.06 | v23.04,56.63 23.04,59.82 24.99,61.77 24.99,71.53 26.01,72.54 30.32,72.54 v31.75,73.98 | v41.25,8.33 41.27,6.35 v41.91,5.71 | v41.25,8.33 41.27,8.31 | v41.25,8.33 35.56,14.02 35.56,18.69 35.15,19.1 v32.92,19.1 | v30.48,76.2 31.75,74.93 v31.75,73.98
N$58  (via drill 0.3)
  Top 0.203: v22.23,56.63 22.23,52.57 30.56,44.24 30.56,32.86 30.15,32.45 27.91,32.45 | 27.91,32.45 27.06,32.45 R7.2 | v28.12,31.44 28.12,32.25 27.91,32.45 | D34.A v39.37,5.71 | v38.61,8.33 39.37,8.89 D33.A 39.37,13.46 39.01,13.82 31.29,13.82 30.68,14.43 30.68,19.3 27.91,22.07 v27.91,23.72 | v29.21,73.98 D13.A | D14.A 27.94,76.61 v27.94,76.2
  Bottom 0.203: v27.91,23.72 27.91,31.23 v28.12,31.44 | v22.23,56.63 22.23,59.61 24.59,61.98 24.59,71.73 25.81,72.95 28.18,72.95 v29.21,73.98 29.21,74.93 v27.94,76.2 | v38.61,8.33 38.73,6.35 v39.37,5.71
RED1
  Top 0.203: IC1.23 14.7,41.18 12.39,43.48 Q1.1
RED1BUS  (via drill 0.3)
  Top 0.203: D1.C 44.48,71.18 | D1.C 44.48,71.17 | v16.87,55.47 16.66,55.07 16.66,50.8 15.65,49.78 13.82,49.78 13.34,49.3 Q1.3 | D1.C D3.C D5.C D7.C D9.C D11.C D13.C D15.C D17.C 21.34,70.7 | 21.34,70.7 D19.C | v21.49,71.25 21.49,70.76 21.34,70.7
  Bottom 0.203: v16.87,55.47 16.87,59.54 19.3,61.98 20.93,61.98 21.34,62.38 21.34,70.84 v21.49,71.25
RED2  (via drill 0.3)
  Top 0.203: Q3.1 5.81,21.54 6.3,21.54 6.71,21.95 6.71,28.72 v8,30.02 | IC1.25 11.23,38.76 v10.77,39.22
  Bottom 0.203: v10.77,39.22 10.16,38.68 10.16,35.56 10.36,35.36 10.36,31.29 10.16,31.09 8.74,31.09 8,30.35 v8,30.02
RED2BUS  (via drill 0.3)
  Top 0.203: D29.C D31.C D33.C D35.C D37.C D39.C 29.62,5.08 20.52,5.08 17.07,8.53 10.77,8.53 9.96,9.35 9.96,12.6 12.19,14.83 12.19,18.69 8.13,22.76 8.13,23.98 v7.92,24.18 | D27.C 9.73,70.97 | v5.56,57.65 5.56,56.43 3.94,54.81 3.94,24.47 5.36,23.04 | v5.56,60.29 5.56,62.05 6.1,62.59 6.1,70.43 6.37,70.7 D27.C | D27.C 9.8,71.04 | 5.36,23.04 Q3.3 | v5.69,24.18 5.69,23.37 5.36,23.04 | D21.C D23.C D25.C D27.C
  Bottom 0.203: v5.56,57.65 v5.56,60.29 | v7.92,24.18 v5.69,24.18
RESET  (via drill 0.3)
  Top 0.203: v10.85,36.11 11.4,35.56 IC1.29 13.21,35.56 14.43,34.34 16.48,34.34 v16.51,34.31 | v8.81,28.8 8.81,22.9 13.89,17.82 13.89,15.95 13.84,15.88 H2.1 13.97,13.65 SW1.1B | v33.2,31.64 33.2,33.73 J6.5 | v32.99,29.2 31.7,27.91 31.7,27.03 29.87,25.2 23.77,25.2 21.95,27.03 21.95,29.46 20.32,31.09 20.32,31.77 v20.4,31.84 20.45,31.9
  Bottom 0.203: v10.85,36.11 10.85,31.03 10.44,30.63 9.22,30.63 8.81,30.22 v8.81,28.8 | v20.4,31.84 17.93,34.31 v16.51,34.31 | v32.99,29.2 32.99,31.64 v33.2,31.64
SCK  (via drill 0.3)
  Top 0.203: 32.59,37.13 32.59,31.23 32.79,31.03 41.94,31.03 44.45,28.52 IC2.9 44.5,27.15 v44.5,25.6 | J6.3 35.64,37.13 32.59,37.13 | IC3.9 44.58,59.07 45.19,59.07 45.39,58.87 45.39,50.95 44.98,50.54 31.17,50.54 v29.54,48.91 | 32.59,37.13 32.59,45.26 30.96,46.88 30.96,47.7 29.74,48.91 v29.54,48.91 | IC4.9 15.32,58.87 23.85,58.87 25.27,57.45 25.27,55.82 25.07,55.62 25.07,52.77 28.93,48.91 v29.54,48.91 | IC1.17 19.5,40.43 20.32,41.25 20.32,42.27 23.77,45.72 26.14,45.72 v26.19,45.76 | SW2.1B 3.71,9.29 5.89,7.11 5.89,2.85 7.52,1.22 45.52,1.22 45.72,1.42 45.72,21.74 v44.5,22.96
  Bottom 0.203: v29.54,48.91 v26.19,45.76 | v44.5,22.96 v44.5,25.6
VCC  (via drill 0.3)
  Top 0.203: 3.5,58.95 C4.1 | 35.43,27.07 IC2.16 35.29,26.93 | D41.A 19.83,8.33 18.9,8.33 18.69,8.53 18.69,11.79 19.05,12.14 H2.3 19.18,15.99
  Top 0.406: 18.05,38.75 17.44,38.75 17.1,39.09 IC1.20 17.14,40.29 | 18.05,38.75 18.25,38.75 18.7,39.2 IC1.18 18.7,44.13 | 18.05,38.75 17.9,38.61 IC1.6 17.9,30.02 | v32.18,57.85 C3.1 | v35.64,57.24 35.56,57.52 IC3.16 | 3.5,58.95 IC4.16 6.38,58.92 6.38,57.85 6.99,57.24 11.86,57.24 12.68,56.43 15.93,56.43 16.94,57.45 17.78,57.45 | 35.29,26.93 C2.1 32.38,26.93 32.38,26.56 32.25,26.56 30.28,24.59 20.18,24.59 | IC2.16 35.64,27.27 | 20.18,24.59 20.18,19.44 19.18,18.43 19.18,15.99 | 20.18,24.59 20.18,28.49 18.66,30.02 17.9,30.02 | v32.18,57.85 32.18,57.91 | 17.78,57.45 v19.38,57.45 | 35.43,27.07 v35.43,24.12 | 17.9,30.02 17.9,28.37 C1.1 | IC1.4 16.3,30.25 16.54,30.02 17.9,30.02 | 18.7,44.13 18.7,52.42 17.78,53.34 17.78,57.45 | 18.7,44.13 C5.1 | v19.38,59.89 30.15,59.89 v32.18,57.85
  Bottom 0.203: v35.43,24.12 35.84,23.72 39.5,23.72 39.93,24.15 J6.2
  Bottom 0.406: v19.38,57.45 v19.38,59.89 | v32.18,57.85 35.03,57.85 v35.64,57.24
WIGGLE10  (via drill 0.3)
  Top 0.203: R14.1 23.85,27.3 v23.77,27.23 | v21.34,27.23 21.34,29.06 19.51,30.89 IC1.8
  Bottom 0.203: v21.34,27.23 v23.77,27.23
WIGGLE11
  Top 0.203: IC1.14 21.72,37.16 22.35,37.8 22.35,39.81 R13.1
WIGGLE12
  Top 0.203: IC1.27 10.79,37.16 9.96,38 7.72,38 7.32,38.41 R12.1 7.32,39.99

### Text on the board
tPlace: SmallRoomLabs.com | ISP | Visulizer v0.3 | Pwr | Conf | Reset